# Altium schematic sheet Condor2a_ESC.SchDoc
size A4
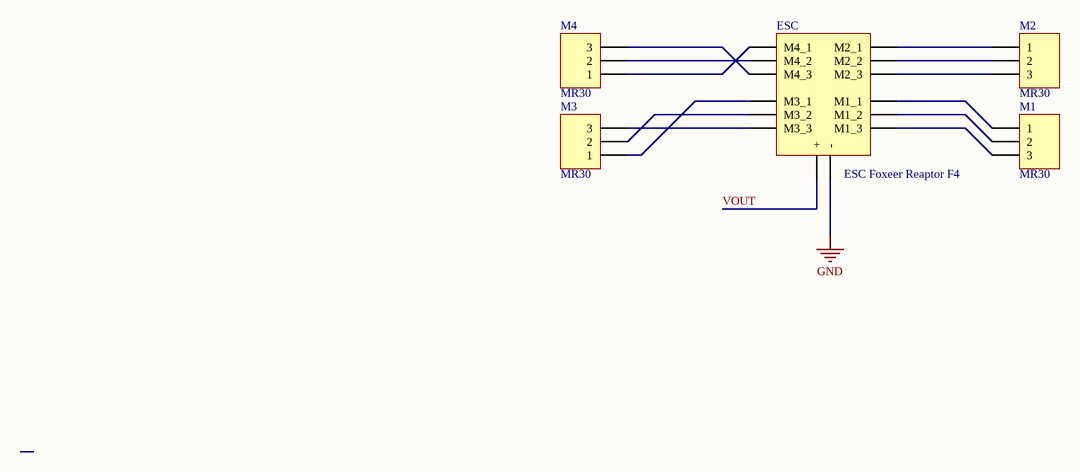
[diagram p0: Condor2a_ESC.SchDoc]

## Parts
ESC  ESC Foxeer Reaptor F4  [FOXEeR REAPER]
M1  MR30  [MR30]
M2  MR30  [MR30]
M3  MR30  [MR30]
M4  MR30  [MR30]

## Nets
GND: ESC.8(-)
VOUT: ESC.7(+)
NetESC_1: ESC.1(M4_1) M4.1
NetESC_2: ESC.2(M4_2) M4.2
NetESC_3: ESC.3(M4_3) M4.3
NetESC_4: ESC.4(M3_1) M3.1
NetESC_5: ESC.5(M3_2) M3.2
NetESC_6: ESC.6(M3_3) M3.3
NetESC_9: ESC.9(M1_3) M1.3
NetESC_10: ESC.10(M1_2) M1.2
NetESC_11: ESC.11(M1_1) M1.1
NetESC_12: ESC.12(M2_3) M2.3
NetESC_13: ESC.13(M2_2) M2.2
NetESC_14: ESC.14(M2_1) M2.1

## Library data of the parts
M1-M4 = MR30: LatestRevisionDate: 17-Jul-2002; LatestRevisionNote: Re-released for DXP Platform.; Publisher: Altium Limited